# EAGLE board DR (EAGLE 9.4.2)
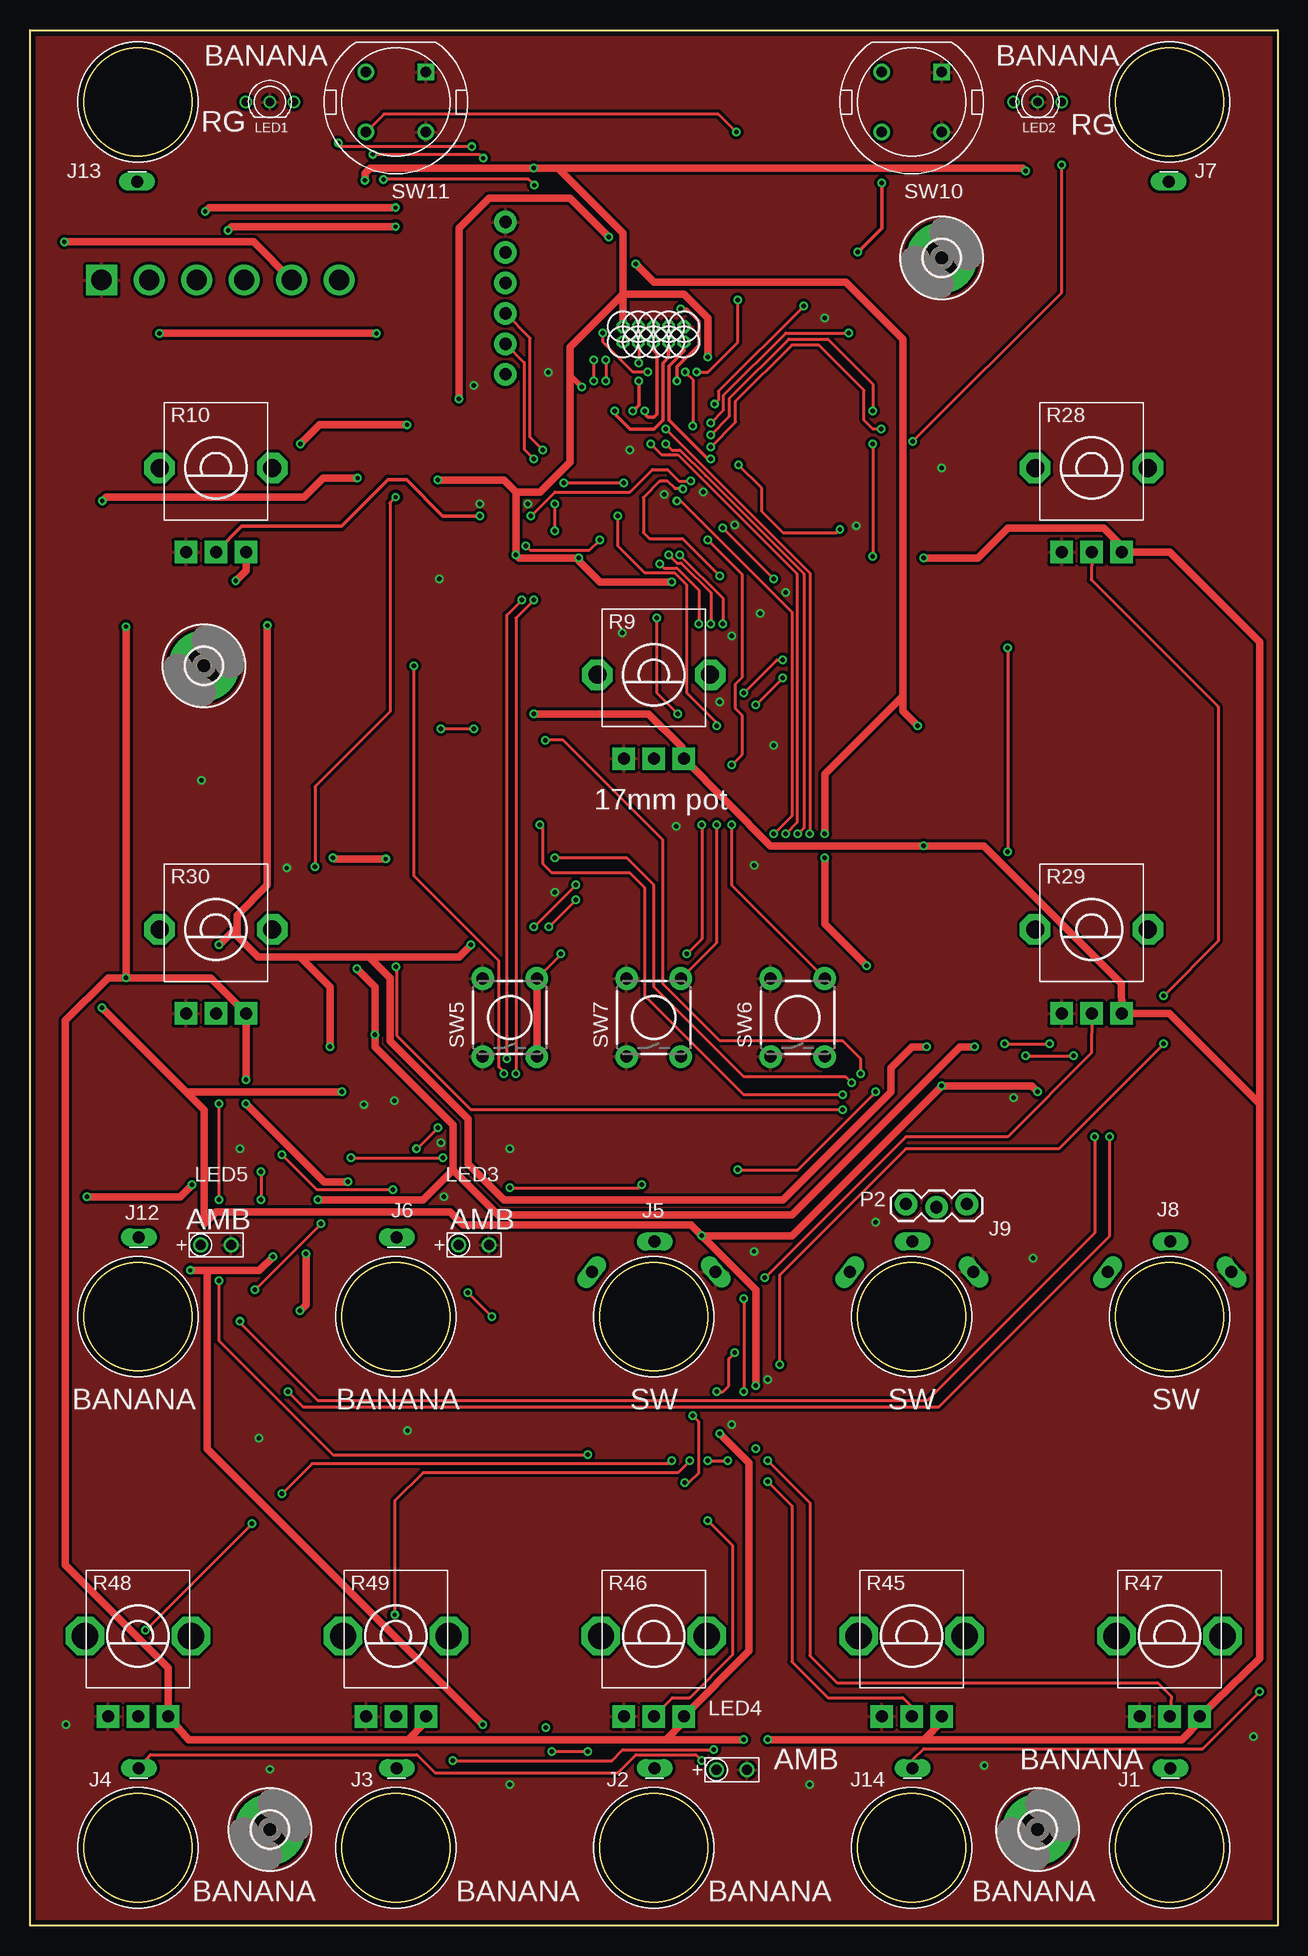
[diagram p5: board, top side]
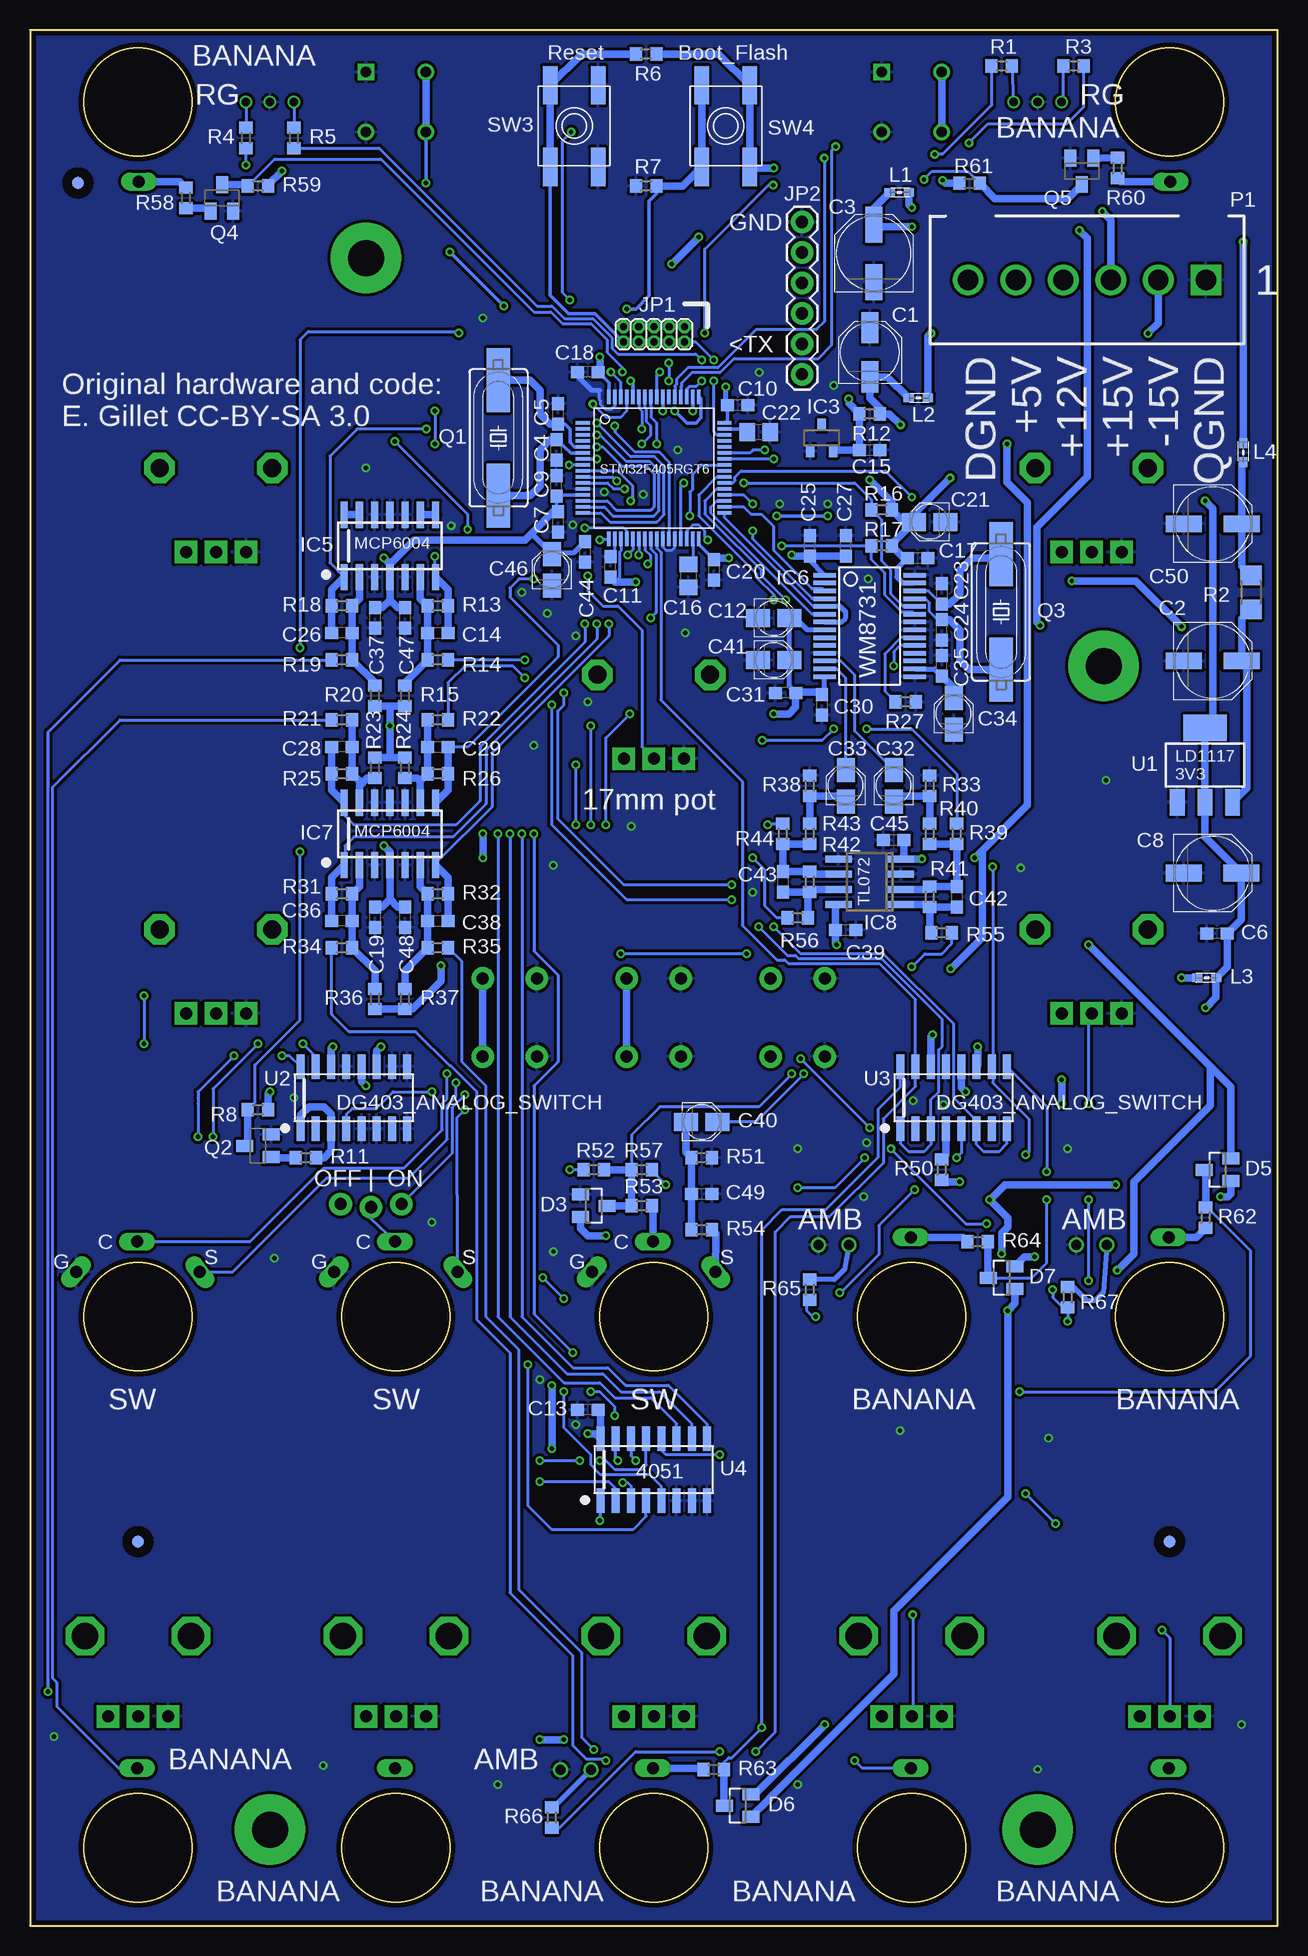
[diagram p6: board, bottom side, seen from below]

Size 104 x 158 mm. Coordinates in mm from the lower left corner, seen from the top.
Outline: 0,0 0,158 104,158 104,0 0,0
Copper layers (1*16): Top 0.0356mm / dielectric 1.5011mm / Bottom 0.0356mm
Design rules "LaenPCBOrder": minimum track width 6mil, minimum drill 13mil, track to track 6mil, track to pad 6mil, pad to pad 6mil, via to via 6mil, smd to smd 6mil, copper to edge 15mil, drill to drill 6mil, minimum pad ring 7mil, minimum via ring 7mil, stop-mask expansion 3mil, vias tented up to drill 0mil, thermal gap 10mil
Net classes: 0 default: width 0.203 mm

## Footprints (pad centres in the part's own frame; a part is rotated, then mirrored left to right if it is on the bottom)
PANASONIC_C = smd 2.6 x 1.4: + 2.05,0; - -2.05,0
PANASONIC_D = smd 3 x 1.4: + 2.4,0; - -2.4,0
C0603 = smd 1.1 x 1: 1 -0.85,0; 2 0.85,0
PANASONIC_A = smd 2 x 1.5: + 1.3,0; - -1.3,0
C0805 = smd 1.3 x 1.5: 1 -0.95,0; 2 0.95,0
SOT23 = smd 1 x 1.4: 1 -0.95,-1.1; 2 0.95,-1.1; 3 0,1.1
FIDUCIAL_1MM = smd 1 x 1: 1 0,0
3,0-PAD = drill 3 pad 5.842: B3,0 0,0
TQFP-10X10-64 = smd 1.2 x 0.3: 1 -5.936,3.75; 2 -5.936,3.25; 3 -5.936,2.75; 4 -5.936,2.25; 5 -5.936,1.75; 6 -5.936,1.25; 7 -5.936,0.75; 8 -5.936,0.25; 9 -5.936,-0.25; 10 -5.936,-0.75; 11 -5.936,-1.25; 12 -5.936,-1.75; 13 -5.936,-2.25; 14 -5.936,-2.75; 15 -5.936,-3.25; 16 -5.936,-3.75; 33 5.886,-3.75; 34 5.886,-3.25; 35 5.886,-2.75; 36 5.886,-2.25; 37 5.886,-1.75; 38 5.886,-1.25; 39 5.886,-0.75; 40 5.886,-0.25; 41 5.886,0.25; 42 5.886,0.75; 43 5.886,1.25; 44 5.886,1.75; 45 5.886,2.25; 46 5.886,2.75; 47 5.886,3.25; 48 5.886,3.75 | smd 0.3 x 1.2: 17 -3.75,-5.911; 18 -3.25,-5.911; 19 -2.75,-5.911; 20 -2.25,-5.911; 21 -1.75,-5.911; 22 -1.25,-5.911; 23 -0.75,-5.911; 24 -0.25,-5.911; 25 0.25,-5.911; 26 0.75,-5.911; 27 1.25,-5.911; 28 1.75,-5.911; 29 2.25,-5.911; 30 2.75,-5.911; 31 3.25,-5.911; 32 3.75,-5.911; 49 3.75,5.936; 50 3.25,5.936; 51 2.75,5.936; 52 2.25,5.936; 53 1.75,5.936; 54 1.25,5.936; 55 0.75,5.936; 56 0.25,5.936; 57 -0.25,5.936; 58 -0.75,5.936; 59 -1.25,5.936; 60 -1.75,5.936; 61 -2.25,5.936; 62 -2.75,5.936; 63 -3.25,5.936; 64 -3.75,5.936
DBZ_R-PDSO-G3 = smd 0.7 x 1: 1 -0.95,-1.1; 2 0.95,-1.1; 3 0,1.1
SO14 = smd 0.6 x 2.2: 1 -3.81,-2.6; 2 -2.54,-2.6; 3 -1.27,-2.6; 4 0,-2.6; 5 1.27,-2.6; 6 2.54,-2.6; 7 3.81,-2.6; 8 3.81,2.6; 9 2.54,2.6; 10 1.27,2.6; 11 0,2.6; 12 -1.27,2.6; 13 -2.54,2.6; 14 -3.81,2.6
SSOP28 = smd 0.381 x 1.905: 1 -4.55,-3.752; 2 -3.9,-3.752; 3 -3.25,-3.752; 4 -2.6,-3.752; 5 -1.95,-3.752; 6 -1.3,-3.752; 7 -0.65,-3.752; 8 0,-3.752; 9 0.65,-3.752; 10 1.3,-3.752; 11 1.95,-3.752; 12 2.6,-3.752; 13 3.25,-3.752; 14 3.9,-3.752; 15 3.9,3.752; 16 3.25,3.752; 17 2.6,3.752; 18 1.95,3.752; 19 1.3,3.752; 20 0.65,3.752; 21 0,3.752; 22 -0.65,3.752; 23 -1.3,3.752; 24 -1.95,3.752; 25 -2.6,3.752; 26 -3.25,3.752; 27 -3.9,3.752; 28 -4.55,3.752
SO08 = smd 0.6 x 2.2: 1 -1.905,-2.6; 2 -0.635,-2.6; 3 0.635,-2.6; 4 1.905,-2.6; 5 1.905,2.6; 6 0.635,2.6; 7 -0.635,2.6; 8 -1.905,2.6
JOHNSON = drill 1 long: 1 0.08,6.635
SWITCH_JOHNSON = drill 1 long: C 0.08,6.27; G 5.16,3.73; S -5.16,3.73
2X5-1.27 = drill 0.61 pad 1.067 octagon: 1 -1.27,3.81; 2 0,3.81; 3 -1.27,2.54; 4 0,2.54; 5 -1.27,1.27; 6 0,1.27; 7 -1.27,0; 8 0,0; 9 -1.27,-1.27; 10 0,-1.27
1X06 = drill 1.016 pad 1.88: 1 0,0; 2 2.54,0; 3 5.08,0; 4 7.62,0; 5 10.16,0; 6 12.7,0
0603 = smd 0.85 x 0.7: 1 -0.9,0; 2 0.7,0
LED-BICOLOR-THROUGHHOLE = drill 0.7: 1 -2,0; 2 0,0; 3 2,0
LED_3MM_MIN = drill 0.813: A -1.27,0; K 1.27,0
MTA_156 = drill 1.7 square: 1 -9.9,0 | drill 1.7: 2 -5.94,0; 3 -1.98,0; 4 1.98,0; 5 5.94,0; 6 9.9,0
1X03_LOCK = drill 1.016 pad 1.88: 1 0,0.127; 2 2.54,-0.127; 3 5.08,0.127
HC49UP = smd 5.334 x 1.93: 1 -4.826,0; 2 4.826,0
SOT23-BEC = smd 1 x 1.4: B -0.95,-1.1; C 0,1.1; E 0.95,-1.1
R0603 = smd 1 x 1.1: 1 -0.85,0; 2 0.85,0
R1206 = smd 1.6 x 1.803: 1 -1.422,0; 2 1.422,0
ALPS_POT_VERTICAL_PS = drill 1 pad 1.88 square: P$1 -2.5,7; P$2 0,7; P$3 2.5,7 | drill 1.5 pad 2.54 octagon: P$4 -4.7,0; P$5 4.7,0
ALPS_POT_VERTICAL = drill 1 pad 1.88 square: P$1 -2.5,6.7; P$2 0,6.7; P$3 2.5,6.7 | drill 2.2 pad 3.175 octagon: P$4 -4.4,0; P$5 4.4,0
EVQ-Q2 = smd 3.2 x 1.2: A -3.4,-2; A' 3.4,-2; B -3.4,2; B' 3.4,2
TACTILE-PTH = drill 1.016 pad 1.88: 1 -3.251,2.261; 2 3.251,2.261; 3 -3.251,-2.261; 4 3.251,-2.261
C&K_D6R = drill 0.9 square: 1 2.5,2.5 | drill 0.9: 2 2.5,-2.5; 3 -2.5,-2.5; 4 -2.5,2.5
SOT223 = smd 1.219 x 2.235: 1 -2.311,-3.099; 2 0,-3.099; 3 2.311,-3.099 | smd 3.6 x 2.2: TAB 0,3.099
SO16 = smd 0.66 x 2.032: 1 -4.445,-2.591; 2 -3.175,-2.591; 3 -1.905,-2.591; 4 -0.635,-2.591; 5 0.635,-2.591; 6 1.905,-2.591; 7 3.175,-2.591; 8 4.445,-2.591; 9 4.445,2.591; 10 3.175,2.591; 11 1.905,2.591; 12 0.635,2.591; 13 -0.635,2.591; 14 -1.905,2.591; 15 -3.175,2.591; 16 -4.445,2.591

## Placement (x,y rotation side)
C1  22u  [PANASONIC_C]  33.97,131.13 90 bottom
C2  47u  [PANASONIC_D]  5.4,105.41 0 bottom
C3  47u  [PANASONIC_D]  33.66,139.38 90 bottom
C4  18p  [C0603]  60.12,123 90 bottom
C5  18p  [C0603]  60,126 270 bottom
C6  100n  [C0603]  5.05,82.68 180 bottom
C7  1u  [C0603]  60,117 270 bottom
C8  47u  [PANASONIC_D]  5.41,87.73 0 bottom
C9  100n  [C0603]  60.12,120 90 bottom
C10  100n  [C0603]  45,126.75 0 bottom
C11  100n  [C0603]  55.62,113.25 90 bottom
C12  10u  [PANASONIC_A]  42,109 0 bottom
C13  100n  [C0603]  57.5,43 180 bottom
C14  2.2n  [C0603]  70,107.75 0 bottom
C15  100n  [C0603]  34,123 0 bottom
C16  2.2u  [C0805]  49.12,112.5 270 bottom
C17  100n  [C0603]  30,114 0 bottom
C18  1u  [C0603]  57.5,129.5 180 bottom
C19  100n  [C0603]  75.25,84.05 270 bottom
C20  100n  [C0603]  47,113 270 bottom
C21  10u  [PANASONIC_A]  29,117 180 bottom
C22  2.2u  [C0805]  43.25,124.5 0 bottom
C23  18p  [C0603]  28,111 270 bottom
C24  18p  [C0603]  28,108 90 bottom
C25  100n  [C0603]  39,115 90 bottom
C26  10n  [C0603]  78,107.75 180 bottom
C27  100n  [C0603]  36,115 90 bottom
C28  10n  [C0603]  78,98.25 180 bottom
C29  2.2n  [C0603]  70,98.25 0 bottom
C30  1u  [C0603]  38,101.75 270 bottom
C31  100n  [C0603]  41,102.75 180 bottom
C32  10u  [PANASONIC_A]  32,95 90 bottom
C33  10u  [PANASONIC_A]  36,95 90 bottom
C34  10u  [PANASONIC_A]  27,101 90 bottom
C35  100n  [C0603]  28,105 90 bottom
C36  10n  [C0603]  78,83.75 180 bottom
C37  100n  [C0603]  75.25,109 270 bottom
C38  10n  [C0603]  70,83.75 0 bottom
C39  100n  [C0603]  36,83 0 bottom
C40  10u  [PANASONIC_A]  48,67 0 bottom
C41  10u  [PANASONIC_A]  42,105.5 0 bottom
C42  18p  [C0603]  26.75,85.75 270 bottom
C43  18p  [C0603]  41.25,87 270 bottom
C44  100n  [C0603]  57.75,114.5 270 bottom
C45  100n  [C0603]  32,90.5 0 bottom
C46  10u  [PANASONIC_A]  60.5,113 90 bottom
C47  100n  [C0603]  72.75,109 270 bottom
C48  100n  [C0603]  72.75,84.05 270 bottom
C49  220p  [C0603]  48,61 0 bottom
C50  47u  [PANASONIC_D]  5.4,116.84 0 bottom
D3  BAT54S  [SOT23]  57,60 270 bottom
D5  BAT54S  [SOT23]  5,63 90 bottom
D6  BAT54S  [SOT23]  45,10 90 bottom
D7  BAT54S  [SOT23]  23,54 90 bottom
FD1  FIDUCIAL  [FIDUCIAL_1MM]  9,32 0 bottom
FD2  FIDUCIAL  [FIDUCIAL_1MM]  95,32 0 bottom
FD3  FIDUCIAL  [FIDUCIAL_1MM]  100,145.25 0 bottom
H1  3MM_MOUNT_HOLE  [3,0-PAD]  20,8 0 top
H2  3MM_MOUNT_HOLE  [3,0-PAD]  84,8 0 top
H3  3MM_MOUNT_HOLE  [3,0-PAD]  76,139 0 top
H4  3MM_MOUNT_HOLE  [3,0-PAD]  14.5,105 0 top
IC2  STM32F405RGT6  [TQFP-10X10-64]  51.99,121.49 0 bottom
IC3  LM4040B10  [DBZ_R-PDSO-G3]  38,124 0 bottom
IC5  MCP6004  [SO14]  74,115 0 bottom
IC6  WM8731  [SSOP28]  34,108 270 bottom
IC7  MCP6004  [SO14]  74,91 0 bottom
IC8  TL072  [SO08]  34,87 90 bottom
J1  JOHNSON_BANANASTD  [JOHNSON]  95,6.48 0 top
J2  JOHNSON_BANANASTD  [JOHNSON]  52,6.48 0 top
J3  JOHNSON_BANANASTD  [JOHNSON]  30.5,6.48 0 top
J4  JOHNSON_BANANASTD  [JOHNSON]  9,6.48 0 top
J5  SWITCHCRAFT_42A  [SWITCH_JOHNSON]  52,50.73 0 top
J6  JOHNSON_BANANASTD  [JOHNSON]  30.5,50.73 0 top
J7  JOHNSON_BANANASTD  [JOHNSON]  95,152 180 top
J8  SWITCHCRAFT_42A  [SWITCH_JOHNSON]  95,50.73 0 top
J9  SWITCHCRAFT_42A  [SWITCH_JOHNSON]  73.5,50.73 0 top
J12  JOHNSON_BANANASTD  [JOHNSON]  9,50.73 0 top
J13  JOHNSON_BANANASTD  [JOHNSON]  9,152 180 top
J14  JOHNSON_BANANASTD  [JOHNSON]  73.5,6.48 0 top
JP1  M05X2MINIJTAG  [2X5-1.27]  53.24,132 270 bottom
JP2  [1X06]  39.63,142 270 bottom
L1  FB R0603  [0603]  31.43,144.46 0 bottom
L2  FB R0603  [0603]  29.84,127.32 0 bottom
L3  [0603]  6,79 180 bottom
L4  FB R0603  [0603]  2.86,122.87 90 bottom
LED1  WP115VEGW  [LED-BICOLOR-THROUGHHOLE]  20,152 0 top
LED2  WP115VEGW  [LED-BICOLOR-THROUGHHOLE]  84,152 0 top
LED3  LED_3MM_MIN  [LED_3MM_MIN]  37,56.73 0 top
LED4  LED_3MM_MIN  [LED_3MM_MIN]  58.5,12.98 0 top
LED5  LED_3MM_MIN  [LED_3MM_MIN]  15.5,56.73 0 top
P1  BU_PWR_NO_I2C  [MTA_156]  15.88,137.16 180 bottom
P2  [1X03_LOCK]  73.03,60.01 0 top
Q1  8MHz  [HC49UP]  64.95,124 90 bottom
Q2  MMBT3904  [SOT23-BEC]  85,65 90 bottom
Q3  12.288MHz  [HC49UP]  23.05,109.5 270 bottom
Q4  MMBT3904  [SOT23-BEC]  88,144 0 bottom
Q5  MMBT3904  [SOT23-BEC]  16.32,146.22 180 bottom
R1  180  [R0603]  23,155 0 bottom
R2  4.7  [R1206]  2.22,111.12 90 bottom
R3  180  [R0603]  17,155 180 bottom
R4  180  [R0603]  86,149 90 bottom
R5  180  [R0603]  82,149 90 bottom
R6  10k  [R0603]  52.63,156 0 bottom
R7  10k  [R0603]  52.63,145 0 bottom
R8  10k  [R0603]  85,68 0 bottom
R9  10kB  [ALPS_POT_VERTICAL_PS]  52,104.25 180 top
R10  10kB  [ALPS_POT_VERTICAL_PS]  15.5,121.49 180 top
R11  100k  [R0603]  81,64 180 bottom
R12  2.2k  [R0603]  34,126 180 bottom
R13  47k  [R0603]  70,110 180 bottom
R14  100k  [R0603]  70,105.5 0 bottom
R15  180k  [R0603]  72.75,102.5 270 bottom
R16  2.2k  [R0603]  33,118 0 bottom
R17  2.2k  [R0603]  33,115 0 bottom
R18  10K  [R0603]  78,110 0 bottom
R19  100k  [R0603]  78,105.5 180 bottom
R20  62K  [R0603]  75.25,102.5 270 bottom
R21  100k  [R0603]  78,100.5 180 bottom
R22  100k  [R0603]  70,100.5 0 bottom
R23  62K  [R0603]  75.25,96.5 90 bottom
R24  62K  [R0603]  72.75,96.5 90 bottom
R25  10K  [R0603]  78,96 0 bottom
R26  10K  [R0603]  70,96 180 bottom
R27  36k  [R0603]  31,102 0 bottom
R28  10kB  [ALPS_POT_VERTICAL_PS]  88.5,121.49 180 top
R29  10kB  [ALPS_POT_VERTICAL_PS]  88.5,83.03 180 top
R30  10kB  [ALPS_POT_VERTICAL_PS]  15.5,83.03 180 top
R31  10K  [R0603]  78,86 0 bottom
R32  10K  [R0603]  70,86 180 bottom
R33  47k  [R0603]  29,95 270 bottom
R34  100k  [R0603]  78,81.5 180 bottom
R35  100k  [R0603]  70,81.5 0 bottom
R36  62K  [R0603]  75.25,77.23 270 bottom
R37  62K  [R0603]  72.75,77.23 270 bottom
R38  47k  [R0603]  39,95 270 bottom
R39  47k  [R0603]  26.75,91 90 bottom
R40  16K  [R0603]  29,91 90 bottom
R41  47k  [R0603]  29,85.75 90 bottom
R42  47k  [R0603]  39,87 90 bottom
R43  16K  [R0603]  39,91 90 bottom
R44  47k  [R0603]  41.25,91 90 bottom
R45  10kB  [ALPS_POT_VERTICAL]  73.5,24.13 180 top
R46  10kB  [ALPS_POT_VERTICAL]  52,24.13 180 top
R47  10kB  [ALPS_POT_VERTICAL]  95,24.13 180 top
R48  10kB  [ALPS_POT_VERTICAL]  9,24.13 180 top
R49  10kB  [ALPS_POT_VERTICAL]  30.5,24.13 180 top
R50  3.3M  [R0603]  28,63 270 bottom
R51  16K  [R0603]  48,64 180 bottom
R52  100k  [R0603]  57,63 180 bottom
R53  1M  [R0603]  53,60 0 bottom
R54  36k  [R0603]  48,58 0 bottom
R55  1.0k  [R0603]  28,82.75 180 bottom
R56  1.0k  [R0603]  40,84 0 bottom
R57  470k  [R0603]  53,63 0 bottom
R58  100k  [R0603]  91,144 270 bottom
R59  10k  [R0603]  85,145 0 bottom
R60  100k  [R0603]  13.34,146.49 90 bottom
R61  10k  [R0603]  25.67,145.22 180 bottom
R62  2.2K  [R0603]  6,59 90 bottom
R63  2.2K  [R0603]  47,13 0 bottom
R64  2.2K  [R0603]  25,57 0 bottom
R65  510R  [R0603]  39,53 270 bottom
R66  510R  [R0603]  60.5,9 270 bottom
R67  510R  [R0603]  17.5,52.37 270 bottom
SW3  [EVQ-Q2]  58.63,150 90 bottom
SW4  [EVQ-Q2]  46,150 270 bottom
SW5  [TACTILE-PTH]  40,75.69 90 top
SW6  [TACTILE-PTH]  64,75.69 90 top
SW7  [TACTILE-PTH]  52,75.69 90 top
SW10  [C&K_D6R]  73.5,152 0 top
SW11  [C&K_D6R]  30.5,152 0 top
U1  LM1117MPX-3.3  [SOT223]  6.05,96.73 0 bottom
U2  DG403_ANALOG_SWITCH  [SO16]  77,69 0 bottom
U3  DG403_ANALOG_SWITCH  [SO16]  27,69 0 bottom
U4  4051  [SO16]  52,38 0 bottom

## Tracks (layer width: path | path; a pad name or v marks a point on that pad's centre or on a via)
+3V3  (via drill 0.35)
  Top 0.406: v46,128.25 45,129.25
  Top 0.61: v6,76.5 13,69.5 | 13,69.5 v26,69.5 | 13,69.5 14.54,67.96 14.54,58.5 15.54,59.5 35,59.5 36.12,58.38 55.12,58.38 v56,57.5 | v56,57.5 63.5,57.5 v76,70 83.5,70 v84,69.5 | 44,146.5 v42,146.5 28.36,146.5 27.92,146.05 v27.92,145.47 | 44,146.5 49.44,141.06 49.44,136 | 49.44,136 JP1.1 | 49.44,136 54.5,136 56.5,134 v56.5,130.75 | 49.44,136 45,131.56 45,129.25 45,122 42.5,119.5 40.5,119.5 | v56,57.5 60.5,53 v60.5,45 | 40.5,119.5 v40.5,114.25 40.75,114 v45.75,114 45.75,113.75 47.5,112 v53.5,112 | 40.5,119.5 39.5,120.5 v34,120.5 | v83,146.25 82.75,146.5 44,146.5 | v6.03,118.75 6.35,119.06 22.86,119.06 24.45,120.65 v27.3,120.65
  Bottom 0.254: C18.1 56.5,129.65 | IC2.19 54.75,115.56 54.75,114.59 54.85,114.5 54.85,112.38 55.23,112
  Bottom 0.305: C18.1 55.74,128.59 IC2.64 | C10.1 45.85,125.49 IC2.48 | C20.1 48.24,115.09 IC2.32
  Bottom 0.406: IC6.1 39,113.8 C25.1 | C17.1 31.75,113.1 31.75,112.41 31.24,111.9 IC6.27 | C10.1 46,126.9 v46,128.25
  Bottom 0.61: v6,76.5 5.15,77.35 5.15,79.05 L3.1 4.2,79.9 C6.1 3.01,83.87 C8.+ 6.05,90.77 U1.2 U1.TAB 5.4,100.48 5.4,118.11 v6.03,118.75 | v26,69.5 26.36,69.86 U3.12 | v56,57.5 57.5,57.5 58.1,58.1 D3.2 | v76,70 76.36,70.36 U2.12 | v84,69.5 84.15,69.35 R8.2 | v42,146.5 43.9,146.5 SW4.B' SW4.B 46.6,156 R6.2 | 56.5,129.65 v56.5,130.75 | v34,120.5 32.15,118.65 R16.2 31.15,117 C21.+ | C21.+ 32.15,115.15 R17.2 31.15,114 C17.1 | C27.1 C25.1 40.4,114.15 v40.5,114.25 | v45.75,114 46.85,114 C20.1 | v60.5,45 v60.5,39.75 | v53.5,112 55.23,112 C11.1 | v83,146.25 84.15,145.1 R59.2 | v27.92,145.47 27.67,145.22 R61.2 | v27.3,120.65 30.3,117.66 C21.+
+3V3_A  (via drill 0.35)
  Top 0.61: v8,79 15.05,79 16.9,77.15 16.9,77.13 R30.P$1 v18,70.5 | v18,68.5 24.5,62 v26.5,62 | v8,79 6.5,79 2.92,75.42 2.92,30.07 11.5,21.5 R48.P$1 13.24,15.5 31.5,15.5 | 31.5,15.5 32.9,16.9 R49.P$1 | 31.5,15.5 53,15.5 | 53,15.5 54.49,16.99 R46.P$1 59.95,22.9 59.95,38.55 v57.5,41 | 53,15.5 v59.5,15.5 | v61.5,15.5 74.5,15.5 | 74.5,15.5 76.08,17.07 R45.P$1 | 74.5,15.5 96,15.5 97.66,17.16 R47.P$1 102.5,22.26 102.5,68.5 | 102.5,68.5 94.97,76.03 R29.P$1 90.97,78.53 79.5,90 v74.5,90 61.74,90 R9.P$1 54.34,97.42 54.34,98.22 51.56,101 v42,101 | 102.5,68.5 102.5,107 95,114.5 94.99,114.49 R28.P$1 90.97,115.03 89.5,116.5 81.5,116.5 79,114 v74.5,114 | v8,108.27 v8,79 | v17.14,112.08 18,112.93 R10.P$1
  Bottom 0.305: C46.+ 60.4,114.4 | IC2.13 60.04,119.24 C9.1 60.12,117.97 C7.1
  Bottom 0.406: IC6.8 39.2,108 40.2,109 C12.+ C41.+ 40.7,103.3 C31.1 | C30.1 37.75,102.85 IC6.14 | C44.1 58.7,114.4 60.4,114.4 | C46.+ 62,115.8 62,116.25
  Bottom 0.61: L3.2 v8,79 | v18,70.5 v18,68.5 | v26.5,62 27.85,62 R50.2 | v59.5,15.5 v61.5,15.5 | v57.5,41 56.85,41 U4.16 56.45,42.8 C13.1 | v74.5,90 74,89.5 IC7.4 74,85.55 | 74,85.55 74.65,84.9 C19.1 | 74,85.55 73.35,84.9 C48.1 | v74.5,114 74,113.5 | 74,113.5 IC5.4 74,110.5 | 74,110.5 74.65,109.85 C37.1 | 74,110.5 73.35,109.85 C47.1 | 40.2,102.8 C31.1 | C30.1 38.2,102.8 40.2,102.8 | v42,101 40.75,101 40.2,101.55 40.2,102.8 | 74,113.5 72,115.5 62.75,115.5 62,116.25 60.4,117.85 C7.1 | v17.14,112.08 11.81,112.08 v8,108.27
+5V
  Bottom 0.61: L4.1 3,121.83 C50.+ 3,113.32 R2.2
AREF_-10  (via drill 0.35)
  Top 0.61: v35.75,127.25 35.75,141.5 38.25,144 45,144 v48.25,140.75 | v50.5,138.5 52,137 68,137 72.75,132.25 72.75,102.5 | 72.75,102.5 66.25,96 v66.25,91 | 72.75,102.5 72.75,101.25 v74,100 | v66.25,89 66.25,83.5 v69.75,80
  Bottom 0.61: IC3.2 36.95,123 C15.1 R12.2 35.75,126.9 v35.75,127.25 | v48.25,140.75 v50.5,138.5 | v66.25,91 v66.25,89 | R20.2 74,101.65 | 74,101.65 R15.2 | 74,101.65 v74,100 74,97.35 | R36.2 R37.2 72.11,76.38 69.75,78.75 v69.75,80 | R23.2 74,97.35 | 74,97.35 R24.2
AUX_OUT
  Bottom 0.254: C33.+ 36,104 36.75,104.75 IC6.13
BOOT_FLASH  (via drill 0.35)
  Top 0.305: v54.25,134.75 54.75,134.75 55.75,133.75 55.75,131.75 53.93,129.93 v53.93,128.75
  Bottom 0.305: v54.25,134.75 53.5,134.75 52.38,135.87 52.38,143.75 51.78,144.35 R7.2 | v53.93,128.75 53.74,128.55 IC2.60
  Bottom 0.61: SW4.A SW4.A' 49.6,145 R7.2
BRIGHTNESS_ATT  (via drill 0.35)
  Top 0.254: v61.5,37 63.5,35 63.5,22 66.5,19 72.75,19 73.58,18.18 R45.P$2
  Bottom 0.254: U4.2 55.17,36.42 55.75,37 v61.5,37
BRIGHTNESS_CV  (via drill 0.35)
  Top 0.254: v56.75,123.25 58.82,125.32 58.82,127.07 63.5,131.75 65.75,131.75 69.54,127.96 69.54,125.46 70.25,124.75 v70.96,124.75
  Bottom 0.254: IC2.14 55.87,118.74 55.13,118 52.25,118 51.95,118.3 51.95,121 52.58,121.62 54.62,121.62 56.25,123.25 v56.75,123.25 | v70.96,124.75 76.75,124.75 79,122.5 79,113.59 IC5.1
  Bottom 0.61: IC5.1 78.85,111.36 R18.1 C26.2
BRIGHTNESS_POT  (via drill 0.35)
  Top 0.254: v62.5,46.75 62.5,54.25 73,64.75 85.75,64.75 v94.5,73.5 | R28.P$2 88.47,112.19 99.06,101.6 99.06,82.06 v94.5,77.5
  Bottom 0.254: U4.4 52.63,34.12 53.75,33 60.5,33 62.5,35 v62.5,46.75 | v94.5,77.5 v94.5,73.5
CV_NORMALIZATION  (via drill 0.35)
  Top 0.254: v26.75,64 v34.41,64 | v40,61.5 50.75,61.5 v51,61.75
  Bottom 0.254: U3.5 26.36,64.39 v26.75,64 | v34.41,64 36.91,61.5 v40,61.5 | v51,61.75 52.15,62.9 R57.2
DAMP_ATT  (via drill 0.35)
  Top 0.254: v56.5,38.75 v58.16,38.75 | v61.5,38.75 65,35.25 65,22.5 67.25,20.25 94,20.25 95.16,19.09 R47.P$2
  Bottom 0.254: U4.13 52.63,38.37 53,38 55.25,38 56,38.75 v56.5,38.75 | v58.16,38.75 v61.5,38.75
DAMP_CV  (via drill 0.35)
  Top 0.254: v54.16,114.25 57.75,110.66 v57.75,108.5
  Bottom 0.254: IC2.21 53.75,115.56 53.75,114.68 53.91,114.52 53.91,114.5 v54.16,114.25 | v57.75,108.5 57.75,107 66.5,98.25 66.5,93.75 68.5,91.75 77,91.75 77.81,92.56 IC7.14
  Bottom 0.61: IC7.14 78.85,94.64 R25.1 C28.2
DAMP_POT  (via drill 0.35)
  Top 0.254: R29.P$2 88.47,72.72 81.5,65.75 73,65.75 v61.25,54 | v59.5,52.25 v59.5,44.5
  Bottom 0.254: v61.25,54 v59.5,52.25 | U4.5 51.37,36.62 52.33,37.58 56.42,37.58 57.25,38.41 57.25,39.25 59.5,41.5 v59.5,44.5
FM_CV  (via drill 0.35)
  Top 0.254: v57.75,116.5 v62,112.25
  Bottom 0.254: IC2.20 54.24,116.24 54.5,116.5 v57.75,116.5 | v62,112.25 63.25,112.25 64,111.5 64,110.75 60,106.75 60,105.75 67.5,98.25 C29.2
  Bottom 0.61: IC7.8 69.15,94.64 R26.1 C29.2
FM_INPUT  (via drill 0.35)
  Bottom 0.254: R63.2 46.15,13.6 45.75,14 45.5,14 v43,16.5 43,57.97 41.3,59.67 37.66,59.67 33.28,64.04 33.28,68.04 31.45,69.88 U3.16
  Bottom 0.61: R63.2 46.15,10.05 D6.3
FM_NORM
  Bottom 0.61: R50.1 27.64,64.22 U3.4
FM_SOURCE  (via drill 0.35)
  Top 0.254: v43.25,83.25 v45.5,85.5 | v60.5,101.75 v62.75,104
  Bottom 0.254: U3.1 31.45,65.19 30.75,64.5 29.5,64.5 28.91,65.09 U3.3 28.91,68.84 28.25,69.5 28.25,73 28,73.25 28,75.58 33.02,80.59 39.92,80.59 40.2,80.88 40.88,80.88 v43.25,83.25 | v45.5,85.5 54.25,85.5 60.5,91.75 v60.5,101.75 | v62.75,104 63.75,105 67.75,105 69.15,103.6 R22.2
FREQUENCY_ATT  (via drill 0.35)
  Top 0.254: R46.P$2 53.56,19 55,19 58.59,22.59 58.59,31.66 v56.5,33.75
  Bottom 0.254: v56.5,33.75 56.45,33.8 U4.1
FREQUENCY_POT  (via drill 0.35)
  Top 0.254: v57.5,112.5 54.38,115.62 51.62,115.62 51.12,116.12 51.12,119.03 52.48,120.39 53.16,120.39 53.8,119.75 v54.43,119.75
  Bottom 0.254: R9.P$2 53,98.27 53,108 55,110 56.25,110 57.5,111.25 v57.5,112.5 | IC2.11 55.85,120.24 55.36,119.75 v54.43,119.75
GATE_MODE  (via drill 0.35)
  Top 0.254: v54.62,129.5 55.25,128.87 v55.25,125
  Bottom 0.254: R59.1 83.6,147.25 74.75,147.25 62,134.5 60.58,134.5 59.61,133.54 57.24,133.54 55.91,132.21 55.91,131.16 54.62,129.87 v54.62,129.5 | v55.25,125 55.25,124.5 53.59,122.84 51.58,122.84 50.74,122 IC2.27
  Bottom 0.61: Q4.C 85.95,145.1 R59.1
GATE_POLY  (via drill 0.35)
  Top 0.254: v51.5,129.5 50.25,129.5 47.75,132 v47.75,132.75 | v42.04,145.07 41.56,145.54 v29.48,145.54
  Bottom 0.254: IC2.56 51.74,129.26 v51.5,129.5 | v47.75,132.75 47.75,139.75 42.43,145.07 v42.04,145.07 | v29.48,145.54 28.8,146.22 25.82,146.22 R61.1
  Bottom 0.61: Q5.C 17.49,143.95 23.55,143.95 R61.1
GEOMETRY_ATT  (via drill 0.35)
  Top 0.254: v53.5,38.75 53.25,38.5 23.5,38.5 v21,36 | v9.62,24.62 v18.5,33.5
  Bottom 0.254: U4.14 53.91,39.16 v53.5,38.75 | v18.5,33.5 v21,36 | v9.62,24.62 9,24 R48.P$2
GEOMETRY_CV  (via drill 0.35)
  Top 0.254: v53.25,114.25 53.5,114 53.5,113.98 53.92,113.56 54.27,113.56 56.75,111.09 v56.75,108.5
  Bottom 0.254: IC2.22 53.24,114.26 v53.25,114.25 | v56.75,108.5 56.75,107.25 66,98 66,93.5 68.75,90.75 77,90.75 77.75,90 77.75,88.46 IC7.1
  Bottom 0.61: IC7.1 78.85,87.36 R31.1 C36.2
GEOMETRY_POT  (via drill 0.35)
  Top 0.254: v41.75,117.5 43.75,119.5 50,119.5 51.88,121.38 53.12,121.38 54.09,120.41 v55.09,120.41
  Top 0.305: v37.5,117.5 34.41,117.5 31.38,120.53 29.84,120.53 25.96,116.64 17.66,116.64 R10.P$2
  Bottom 0.254: IC2.10 55.42,120.74 v55.09,120.41
  Bottom 0.305: v37.5,117.5 v41.75,117.5
GND  (via drill 0.35)
  Bottom 0.254: C11.2 55.25,114.47 55.25,114.66 55.24,114.68 IC2.18 | IC2.26 51.24,114.89 50.99,114.64 50.48,114.64 50.24,114.89 IC2.28 | IC2.63 55.24,126.69 55.56,126.36 56.04,126.36 56.44,126.76 56.44,127.08 56.52,127.16 56.52,127.95
  Bottom 0.406: 56.52,127.95 57.15,127.95 58.35,129.15 C18.2
  other vias: 65,11.75 79.56,13.34 102,15.75 40,11.75 20,13.02 3,16.75 61.5,45.5 58.5,41.75 76,121.5 68.89,116.68 66.25,134 50,123 60.88,109.38 57.5,102 21.41,88.15 14.3,95.45 40,64.75 17.5,64.75 34.5,60.75 34.25,65.25 82,69 56.12,119.5 63,111.12 58.75,116.75 41.5,118.5 37,128.38 34.12,112.25 37.5,118.5 58.5,107.5 62,98.38 60.38,88.38 53.88,91.62 43.75,86.12 70.5,58.62 83.62,55.62 30.38,68.75 52.88,119.3 49.38,107.75 43.2,129.46 27.84,68.43 19.09,40.62 31.47,41.26 60.36,56.18
  pour Bottom (isolate 0.254): 103.68,0.32 103.68,157.68 0.32,157.68 0.32,0.32
  pour Top (isolate 0.254): 103.68,0.32 103.68,157.68 0.32,157.68 0.32,0.32
I2C_SCL  (via drill 0.35)
  Top 0.254: v49.5,120.25 v44.5,120.25
  Bottom 0.254: IC6.24 31.2,109.95 32.25,111 32.25,113 33,113.75 33,117.15 R16.1 33.85,118.85 35.25,120.25 v44.5,120.25 | IC2.29 49.74,120.01 v49.5,120.25
I2C_SDA  (via drill 0.35)
  Top 0.254: v41.34,115 41.68,114.66 46.66,114.66 v47.5,115.5
  Bottom 0.254: IC6.23 30.43,109.48 31.32,109.48 32.75,110.91 32.75,112.75 33.85,113.85 R17.1 v41.34,115 | IC2.30 49.24,116.26 48.75,116.75 48.25,116.75 47.75,116.25 47.75,115.75 v47.5,115.5
I2S_LRCK
  Bottom 0.254: IC6.5 38.7,109.95 46.1,117.35 IC2.33
  Bottom 0.406: IC6.7 36.35,108.65 36,109 36,109.5 36.45,109.95 IC6.5
I2S_SCK
  Bottom 0.254: IC6.3 37.93,111.43 38.82,111.43 42,114.61 42,116.62 43,117.62 43.88,117.62 44.49,118.24 IC2.34
I2S_SIN
  Bottom 0.254: IC6.6 38.8,109.3 46.81,117.31 46.82,117.31 47.25,117.74 47.25,118.25 46.76,118.74 IC2.35
I2S_SOUT  (via drill 0.35)
  Top 0.254: v43.75,116.25 43.75,117.62 v43.75,118.5
  Bottom 0.254: IC6.4 38.77,110.6 43.75,115.58 v43.75,116.25 | v43.75,118.5 44.49,119.24 IC2.36
IN_1
  Bottom 0.254: IC6.20 31.4,107.35 32.75,106 32.75,102.9 R27.1
IN_2  (via drill 0.35)
  Top 0.254: v32,105 32,87.5 39.1,80.4 39.1,71.56 39.5,71.16 v39.5,71
  Bottom 0.254: IC6.19 31.48,106.7 32,106.17 v32,105 | v39.5,71 43.5,67 C40.+
JTCK  (via drill 0.35)
  Top 0.254: JP1.4 50.75,131.96 v50.75,130.25
  Top 0.305: v50.25,126.25 50.75,126.75 v50.75,128.75
  Bottom 0.254: v50.75,130.25 v50.75,128.75
  Bottom 0.305: IC2.49 48.07,127.25 48.07,125.68 48.5,125.25 49.25,125.25 v50.25,126.25
JTDI  (via drill 0.35)
  Top 0.305: JP1.8 53.24,130.75 52.75,130.25 52.75,125.5 52,124.75 50,124.75 48.75,126 v48.75,126.25
  Bottom 0.305: v48.75,126.25 48.75,127.41 IC2.50
JTDO  (via drill 0.35)
  Top 0.305: JP1.6 51.98,131.29 52.25,131.02 52.25,126 52,125.75 51.5,125.75 51.25,126 v51.25,126.25
  Bottom 0.305: IC2.55 51.24,126.26 v51.25,126.25
JTMS  (via drill 0.35)
  Top 0.254: v47,128.75 v47,130.5
  Bottom 0.254: IC2.46 46.11,124.25 46.76,124.25 47,124.49 v47,128.75 | v47,130.5 48.5,132 JP1.2
MAIN_OUT
  Bottom 0.254: C32.+ 35.25,99.55 35.25,104.25 36.4,105.4 IC6.12
MUX_ADDR_0  (via drill 0.35)
  Top 0.254: v53,124.75 65,112.75 v65,91
  Bottom 0.254: v65,91 65,50.75 59.5,45.25 56.5,45.25 55.25,44 52.25,44 50.09,41.84 U4.11 | IC2.59 53.24,126.49 53,126.25 v53,124.75
MUX_ADDR_1  (via drill 0.35)
  Top 0.254: v53,123.5 53.5,123 54.17,123 56.34,120.84 64.5,112.67 64.5,91.5 v64,91
  Bottom 0.254: v64,91 64,50.75 59.25,46 56.25,46 54.75,44.5 51.5,44.5 48.83,41.83 U4.10 | v53,123.5 52.25,124.25 52.25,125 52.59,125.34 52.59,126.42 52.74,126.56 IC2.58
MUX_ADDR_2  (via drill 0.35)
  Top 0.254: v51.75,123.5 52.62,122.62 53.3,122.62 53.33,122.59 54.01,122.59 63.92,112.67 63.92,91.92 v63,91
  Bottom 0.254: v63,91 63,50.75 58.75,46.5 55.83,46.5 54.35,45.02 50.77,45.02 47.55,41.8 U4.9 | v51.75,123.5 51.75,125.25 52.19,125.69 52.19,126.59 52.24,126.64 IC2.57
MUXED_POTS  (via drill 0.35)
  Top 0.254: v54.59,36.92 54.92,36.92 55.75,37.75 55.75,42 v55.25,42.5 | v57.25,44.5 57.75,44.5 58.25,45 58.25,47.25 v58.75,47.75 | v62,91 63.5,92.5 63.5,109.5 54.25,118.75 v53.93,118.75
  Bottom 0.254: v62,91 62,81.25 60,79.25 60,72 62,70 62,51 v58.75,47.75 | v54.59,36.92 54.17,36.92 53.91,36.66 U4.3 | v53.93,118.75 53.75,118.93 53.75,120 54.99,121.24 IC2.9 | v55.25,42.5 55.25,43.25 56.5,44.5 v57.25,44.5
N$1  (via drill 0.35)
  Top 0.254: J14.1 73.66,13.9 74.5,14.75 97.75,14.75 v102.5,19.5
  Bottom 0.254: v102.5,19.5 102.5,99.5 96.5,105.5 R19.2
N$2
  Bottom 0.61: IC5.2 76.54,110.61 R18.2 C26.1 R19.1 75.25,103.6 R20.1
N$3
  Bottom 0.61: R58.2 89.2,143.15 Q4.B
N$4
  Bottom 0.61: Q5.B 14.79,147.32 R60.2
N$5
  Bottom 0.61: IC7.9 71.46,95.39 | 71.46,95.39 R26.2 C29.1 R22.1 | 71.46,95.39 71.72,95.65 R24.1
N$6  (via drill 0.35)
  Top 0.254: J4.1 10.03,14.25 32.25,14.25 33.75,12.75 49,12.75 50.5,14.25 55.5,14.25 v56,13.75
  Bottom 0.254: v56,13.75 56.16,13.91 57.66,13.91 58.75,15 58.75,22.5 64,27.75 64,47.75 66.75,50.5 66.75,69.5 68.91,71.66 69,71.66 71.84,74.5 77.41,74.5 78.85,75.94 R34.2
N$7
  Bottom 0.305: C5.2 59.4,125.15 59,124.75 59,123.63 58.6,123.24 IC2.5
  Bottom 0.61: Q1.2 62.33,128.83 61.5,128 61.5,126 60.65,125.15 C5.2
N$8
  Bottom 0.305: C4.2 58.89,122.74 IC2.6
  Bottom 0.61: Q1.1 62.33,119.17 61.5,120 61.5,123 60.65,123.85 C4.2
N$9
  Bottom 0.61: R58.1 91.52,145.37 J7.1
N$10
  Bottom 0.254: J1.1 96.61,13.11 101.75,18.25 101.75,20.25 102.09,20.59 102.09,94.91 96.5,100.5 R21.2
N$11
  Bottom 0.61: 76.54,95 76.54,95.39 R25.2 C28.1 R21.1 | 76.54,95 IC7.13 | 76.54,95 75.89,95.65 R23.1
N$12
  Bottom 0.254: LED1.3 22.11,154.96 R1.2
N$13
  Bottom 0.305: IC2.47 44.44,124.74 C22.1
N$14
  Bottom 0.61: IC5.6 71.46,110.61 R13.2 C14.1 R14.1 72.75,103.6 R15.1
N$15
  Bottom 0.61: IC7.2 76.54,86.61 R31.2 C36.1 R34.1 75.25,79.6 R36.1
N$16
  Bottom 0.61: U1.3 2.55,94.82 2.55,104.96 C2.+ 3,108.93 R2.1
N$17
  Bottom 0.406: IC6.16 28.6,104.75 C35.1
  Bottom 0.61: C34.+ 27,103.15 C35.1
N$18
  Bottom 0.61: R54.1 C49.1 R51.2 49.3,64.45 C40.-
N$19
  Bottom 0.254: IC2.31 48.74,113.84 C16.1
N$20
  Bottom 0.61: R60.1 13.06,145.37 J13.1
N$21
  Bottom 0.61: R54.2 46.83,57.68 J5.S
N$22
  Bottom 0.254: LED1.1 17.85,152.32 R3.2
N$23
  Bottom 0.61: R43.2 R38.2 36.45,94.15 C33.-
N$24
  Bottom 0.406: LED5.A 14.54,52.77 15.24,52.07 15.88,52.07 17.02,53.22 R67.1
N$25
  Bottom 0.61: IC8.6 38.78,87.64 R42.2 C43.1 R44.1 R43.1
N$26  (via drill 0.35)
  Top 0.254: v35.25,13.75 48.5,13.75 49.41,14.66 v57,14.66
  Bottom 0.254: J3.1 34.61,13.11 v35.25,13.75 | v57,14.66 58,15.66 58,22.75 63.25,28 63.25,48 66,50.75 66,70 68,72 68,80.35 R35.2
N$27
  Bottom 0.254: LED2.3 86,151.97 R4.2
N$28
  Bottom 0.61: R56.2 39.15,86 R42.1 | R42.1 C43.2 | R42.1 38.78,86.36 IC8.7
N$29  (via drill 0.35)
  Top 0.254: v68.5,70.25 68,70.75 59.5,70.75 52,78.25 52,86.75 49.75,89 v43.75,89
  Bottom 0.254: J8.S 87.12,54.46 79.26,62.32 72.43,62.32 69.23,65.52 69.23,68.35 68.5,69.08 v68.5,70.25 | R56.1 41.75,84 42.75,85 42.75,88 v43.75,89
N$30
  Bottom 0.61: IC7.6 71.46,86.61 R32.2 C38.1 R35.1 72.75,79.6 R37.1
N$31
  Bottom 0.61: C32.- 31.55,94.15 R33.2 R40.2
N$32
  Bottom 0.61: R40.1 R39.1 C42.1 R41.2 29.23,86.36 IC8.2
N$33
  Bottom 0.61: C42.2 R41.1 | R41.1 29,82.9 R55.2 | R41.1 29.2,85.09 IC8.1
N$34  (via drill 0.35)
  Top 0.254: v30.5,79.92 30.58,79.83 30.58,74.17 36.75,68 v67.75,68
  Bottom 0.254: J9.S 68.42,67.33 v67.75,68 | v30.5,79.92 29.41,81 28,81 27.15,81.85 R55.1
N$35
  Bottom 0.254: LED2.1 82,151.97 R5.2
N$36
  Bottom 0.406: R66.1 60.36,9.85 LED4.A
N$37  (via drill 0.35)
  Top 0.254: v36.83,148.27 26.04,148.27 v25.72,148.59
  Bottom 0.254: IC2.52 49.74,128.26 49.69,128.31 49.69,128.56 48.81,129.44 46.49,129.44 45.3,130.62 38.29,130.62 37.15,131.76 37.15,147.96 v36.83,148.27 | R3.1 16.15,151.6 17.57,150.18 24.13,150.18 v25.72,148.59
N$38
  Bottom 0.61: J12.1 6.78,57.37 R62.1
N$39
  Bottom 0.61: J5.C 52.07,59.92 R53.2
N$40  (via drill 0.35)
  Top 0.254: v86,146.75 86,136.12 v73.58,123.71 | v67.52,116.38 67.27,116.12 62.75,116.12 61,117.88 61,119.81 v59.06,121.75
  Bottom 0.254: v86,146.75 R4.1 | IC2.8 57.94,121.75 v59.06,121.75 | v73.58,123.71 67.52,117.64 v67.52,116.38
N$41
  Bottom 0.254: C24.2 28.35,108.85 29.02,109.52 29.02,110.26 29.36,110.6 IC6.25
  Bottom 0.61: Q3.2 25.67,104.67 26.5,105.5 26.5,108 27.35,108.85 C24.2
N$42
  Bottom 0.254: C23.2 29.1,111.25 IC6.26
  Bottom 0.61: Q3.1 23.37,114 25.5,114 26.5,113 26.5,111 27.35,110.15 C23.2
N$43  (via drill 0.35)
  Top 0.254: v28.57,147.64 37.47,147.64 v37.78,147.32
  Bottom 0.254: IC2.53 50.24,128.33 50.09,128.48 50.09,128.91 49.16,129.84 46.66,129.84 43.44,133.06 38.42,133.06 37.78,133.69 v37.78,147.32 | R1.1 23.85,151.73 27.94,147.64 v28.57,147.64
N$44  (via drill 0.35)
  Top 0.254: v48,130.5 v48,128.75
  Bottom 0.254: R5.1 74.9,148.15 61.75,135 60.5,135 59.44,133.94 57.07,133.94 55.5,132.37 55.5,131.5 55,131 48.5,131 v48,130.5 | v48,128.75 48.45,128.3 49,128.3 49.24,128.07 IC2.51
N$45  (via drill 0.35)
  Top 0.254: v69.25,71 69.25,72.25 67.75,73.75 57.5,73.75 52.75,78.5 52.75,90.5 44.45,98.8 v42.95,98.8 | v37,99.75 v34.25,99.75
  Bottom 0.254: J8.C 85.65,57 79.51,63.13 72.83,63.13 69.63,66.33 69.63,68.52 69.25,68.9 v69.25,71 | v42.95,98.8 37.95,98.8 v37,99.75 | v34.25,99.75 30.5,99.75 26.75,96 R39.2
N$46  (via drill 0.35)
  Top 0.254: v67.75,69.25 59.5,69.25 51.25,77.5 51.25,86.5 50,87.75 43.5,87.75 42.75,88.5 42.75,91.5 v42.5,91.75
  Bottom 0.254: v67.75,69.25 68.82,68.18 68.82,64.34 P2.1 | v42.5,91.75 42.4,91.85 R44.2
N$47
  Bottom 0.254: J9.C 75.56,58.91 P2.2
N$48  (via drill 0.35)
  Top 0.61: v28.89,132.72 v10.79,132.72
  Bottom 0.61: L2.2 29.14,132.46 v28.89,132.72 | v10.79,132.72 9.94,133.57 P1.2
N$49  (via drill 0.35)
  Top 0.61: v2.86,140.34 18.64,140.34 P1.5
  Bottom 0.61: v2.86,140.34 L4.2
N$50  (via drill 0.35)
  Top 0.61: v14.61,142.88 14.92,143.19 v30.48,143.19
  Bottom 0.61: P1.3 13.89,142.16 v14.61,142.88 | v30.48,143.19 30.73,143.44 L1.2
N$51
  Bottom 0.406: LED3.A 36.12,54.68 36.95,53.85 R65.1
N$52
  Bottom 0.61: J2.1 47.96,13.11 R63.1
N$53
  Bottom 0.61: J6.1 26.22,57.37 R64.1
N$57
  Bottom 0.61: IC5.14 IC5.13
N$58
  Bottom 0.61: IC5.9 IC5.8
N$66
  Bottom 0.61: R11.2 83.85,64 Q2.B
NORMAL_FM_CTRL  (via drill 0.35)
  Top 0.254: v46.5,14.5 v43.5,14.5
  Bottom 0.254: R66.2 59.87,8.15 53.52,14.5 v46.5,14.5 | v43.5,14.5 41.91,16.09 41.91,57.78 40.64,59.05 37.38,59.05 32.88,63.56 32.88,67.24 30.18,69.94 U3.15 30.18,77.17 33.19,80.19 40.76,80.19 41.08,80.5 41.75,80.5 44.62,83.38 44.62,95.38 51.4,102.15 51.4,114.47 51.74,114.81 IC2.25
NORMAL_FM_SW  (via drill 0.35)
  Top 0.254: v56.5,115.5 59.38,112.62 59.38,104.06 58.81,103.5 58.81,101.44 59.38,100.88 59.38,97.62 v58.5,96.75 | v58.5,91.75 58.5,86.7 SW6.4
  Bottom 0.254: v58.5,91.75 v58.5,96.75 | v56.5,115.5 56.42,115.58 IC2.17
  Bottom 0.61: SW6.4 SW6.3
NORMAL_PITCH_CTRL  (via drill 0.35)
  Top 0.254: v30.48,119.06 30,118.59 30,101.19 23.75,94.93 v23.75,88.25 | v30.25,61.34 23.91,61.34 v21,64.25 | v36.5,52.75 v38.5,50.75
  Bottom 0.254: IC2.38 45.45,120.24 45.22,120.47 45.22,120.75 44.72,121.25 32.67,121.25 v30.48,119.06 | v23.75,88.25 23.75,71.67 U3.10 23.75,71.52 23.75,70.25 20.75,67.25 20.75,64.5 v21,64.25 | v30.25,61.34 33.25,58.34 33.25,55.95 36.45,52.75 v36.5,52.75 | v38.5,50.75 38.75,50.75 39.25,51.25 39.25,51.9 R65.2
NORMAL_PITCH_SW  (via drill 0.35)
  Top 0.254: v57.25,100 57.25,100.25 54.75,102.75 54.75,111.75 53.75,112.75 51.25,112.75 49,115 v49,117.5 | SW7.4 57.25,81.93 v57.25,91.75
  Bottom 0.254: v57.25,91.75 v57.25,100 | IC2.41 48.01,121.74 48.75,121 48.75,119.75 49,119.5 v49,117.5
  Bottom 0.61: SW7.4 SW7.3
NORMAL_STRUM_CTRL  (via drill 0.35)
  Top 0.254: v17.5,50.37 17.5,50.25 24,43.75 74.75,43.75 88.75,57.75 v88.75,65.75 | v34,66.5 32.25,64.75 v32.22,64.75 | v18.75,53 v24.25,58.5 | v39.75,72.25 39.75,109.25 v41,110.5 | v81.25,73.5 v85,73.5
  Bottom 0.254: IC2.37 46.76,119.74 47.75,118.75 47.75,117.67 46.98,116.9 43.04,112.96 43.04,112.54 v41,110.5 | v17.5,50.37 R67.2 17.9,51.52 18.75,52.37 v18.75,53 | v81.25,73.5 80.17,72.42 U2.15 | v34,66.5 v39.75,72.25 | v32.22,64.75 25.97,58.5 v24.25,58.5 | v85,73.5 88.75,69.75 v88.75,65.75
NORMAL_STRUM_SW  (via drill 0.35)
  Top 0.254: SW5.4 44.25,80.94 v44.25,81 | v56,91.75 56,82.25 v54.75,81 | v54,101 52.25,102.75 v52.25,109
  Top 0.61: SW5.4 SW5.3
  Bottom 0.254: v56,91.75 56,99 v54,101 | IC2.24 52.24,114.74 51.81,114.31 51.81,109.44 v52.25,109 | v44.25,81 v54.75,81
NORMALIZATION_PROBE  (via drill 0.35)
  Top 0.254: v42,110.5 40.5,109 v40.5,71
  Bottom 0.254: IC2.39 46.76,120.74 48.25,119.25 48.25,117.5 43.44,112.69 43.44,112.37 42,110.92 v42,110.5 | v40.5,71 43.25,68.25 51.5,68.25 53.85,65.9 R57.1
  Bottom 0.61: D3.3 R53.1 R57.1 R52.1
PITCH_INPUT  (via drill 0.35)
  Top 0.254: v19.25,62.84 v19.25,60.5
  Bottom 0.254: v19.25,62.84 19.25,68.29 U3.9 | D7.3 20.5,54 19.25,55.25 v19.25,60.5
  Bottom 0.61: R64.2 24.15,54.05 D7.3
PITCH_SOURCE  (via drill 0.35)
  Top 0.254: v42,83.25 v45.5,86.75 | v59.5,102.75 62.25,105.5 v62.75,105.5
  Bottom 0.254: U3.8 22.55,65.19 23.25,64.5 24.5,64.5 25.09,65.09 25.09,66.75 | U3.6 25.09,67.09 27,69 27,75.15 32.85,81 39.75,81 v42,83.25 | v45.5,86.75 54.5,86.75 60,92.25 60,101.25 59.5,101.75 v59.5,102.75 | v62.75,105.5 R14.2
  Bottom 0.305: U3.6 25.09,66.75
POSITION_ATT  (via drill 0.35)
  Top 0.254: v55,38.75 54,37.75 32.75,37.75 30.4,35.4 v30.4,25.9
  Bottom 0.254: v55,38.75 55.17,38.92 U4.15 | v30.4,25.9 30.4,17.53 R49.P$2
POSITION_CV  (via drill 0.35)
  Top 0.254: v52.5,113.5 52.84,113.16 53.92,113.16 55.75,111.33 v55.75,108.5
  Bottom 0.254: IC2.23 52.74,114.66 52.29,114.21 52.29,113.71 v52.5,113.5 | v55.75,108.5 55.75,107.5 65.5,97.75 65.5,93.25 70.19,88.56 IC7.7
  Bottom 0.61: IC7.7 69.15,87.36 R32.1 C38.2
POSITION_POT  (via drill 0.35)
  Top 0.254: v46.5,39.25 25.25,39.25 15.75,48.75 v15.75,53.75 | v15.75,60.5 v15.75,68.5
  Bottom 0.254: v46.5,39.25 51,39.25 51.37,39.62 U4.12 | v15.75,68.5 15.75,75.78 R30.P$2 | v15.75,53.75 v15.75,60.5
RESET  (via drill 0.35)
  Top 0.305: JP1.10 54.52,131.26 53.25,130 53.25,125.5 56.5,122.25 v56.75,122.25
  Bottom 0.305: SW3.B 60.63,135.88 59.12,134.38 56.89,134.38 JP1.10 | v56.75,122.25 57.91,122.25 IC2.7
  Bottom 0.61: R6.1 58.03,156 SW3.B' SW3.B
RX  (via drill 0.35)
  Top 0.254: JP2.4 41.7,132.31 41.7,124.05 v42.75,123
  Bottom 0.254: v42.75,123 43.75,123 44.01,122.74 IC2.43
STRUM  (via drill 0.35)
  Top 0.254: v56.75,125.25 57.82,126.32 57.82,127.57 63,132.75 v68.25,132.75 | v81.5,106.5 v81.5,89.5
  Bottom 0.254: IC2.16 56.4,117.74 55.66,117 51.75,117 51.14,117.61 51.14,121.64 51.94,122.44 53.94,122.44 v56.75,125.25 | v68.25,132.75 68.37,132.87 80.81,132.87 81.5,132.18 v81.5,106.5 | v81.5,89.5 81.5,75.5 85.25,71.75 85.25,68.6 R8.1
  Bottom 0.61: Q2.C 85.85,65.25 R8.1
STRUM_INPUT  (via drill 0.35)
  Top 0.254: v21.5,44.5 22.75,43.25 75.75,43.25 90,57.5 v90,65.75 | v83,72.5 v87,72.5
  Bottom 0.254: R62.2 5.85,59.85 2.25,56.25 2.25,47.5 5.25,44.5 v21.5,44.5 | U2.16 82.35,72.5 v83,72.5 | v90,65.75 90,68.5 90,69 90,69.5 v87,72.5
  Bottom 0.61: R62.2 6,62.9 D5.3
STRUM_NORM  (via drill 0.35)
  Top 0.254: v59,63 64,63 v70.5,69.5
  Bottom 0.254: R52.2 v59,63 | v70.5,69.5 73.75,69.5 75.12,68.12 77.12,68.12 77.64,67.61 U2.4
STRUM_SOURCE
  Bottom 0.61: R11.1 79.5,64 78.91,64.59 U2.3 78.91,67.66 79.5,68.25 80.75,68.25 81.44,67.56 U2.1
SW_MODE  (via drill 0.35)
  Top 0.254: v64.5,135 57.38,127.89 57.38,127.14 v57.07,126.82
  Top 0.305: v71,145.25 71,141.5 v69,139.5
  Bottom 0.254: v57.07,126.82 56,125.75 54.75,125.75 54.24,126.26 IC2.61
  Bottom 0.305: v64.5,135 v69,139.5 | v71,145.25 SW10.3
  Bottom 0.61: SW10.4 SW10.3
SW_POLYPHONY  (via drill 0.35)
  Top 0.254: v59,135.5 59,132 56.5,129.5 v55.57,129.5 | v58.88,149.5 57.38,151 29.5,151 SW11.3
  Bottom 0.254: v59,135.5 59.63,136.13 59.63,148.75 v58.88,149.5 | IC2.62 54.74,128.67 v55.57,129.5
  Bottom 0.61: SW11.4 SW11.3
TX  (via drill 0.35)
  Top 0.254: JP2.5 41.2,130.27 41.2,123.05 v42,122.25
  Bottom 0.254: v42,122.25 42.01,122.24 IC2.42
V_OCT_CV  (via drill 0.35)
  Top 0.254: v56.75,124.25 58.32,125.82 58.32,127.32 63.25,132.25 66.5,132.25 70.25,128.5 v70.25,126.25 | v70.25,123.5 v70.25,114.12
  Bottom 0.254: IC2.15 56.12,118.24 55.38,117.5 52,117.5 51.55,117.95 51.55,121.25 52.33,122.03 54.28,122.03 56.5,124.25 v56.75,124.25 | v70.25,126.25 v70.25,123.5 | IC5.7 70.25,112.46 v70.25,114.12
  Bottom 0.61: IC5.7 69.15,111.36 R13.1 C14.2
VCC  (via drill 0.35)
  Top 0.61: v19.79,108.36 19.79,86.74 17.25,84.2 17.25,83.25 | 17.25,83.25 17.25,82.5 19,80.75 22.5,80.75 | v20.25,55.75 19.11,54.61 15,54.61 | v13.36,54.61 15,54.61 | v36.75,81.75 35.75,80.75 28.25,80.75 | 22.5,80.75 28.25,80.75 | v25,73.25 25,78.25 22.5,80.75 | 17.25,83.25 v15.75,81.75 | 15,54.61 14.75,54.36 14.75,39.75 v37.75,16.75 | 28.25,80.75 30,79 30,73.75 36.5,67.25 36.5,63.5 39.5,60.5 62.75,60.5 71.75,69.5 71.75,71.5 73.5,73.25 v74.75,73.25 | v30.48,141.6 16.83,141.6 v16.51,141.29
  Bottom 0.61: IC8.8 36.85,84.84 C39.1 36.85,81.85 v36.75,81.75 | v13.36,54.61 12,55.97 12,62 5.62,68.38 5.62,71.62 | v20.25,55.75 21.1,55.75 D7.2 | v25,73.25 25,71.69 U3.11 | 5.62,71.62 3.9,69.9 D5.2 | D6.2 43.55,10.95 v37.75,16.75 | v74.75,73.25 75.09,72.91 U2.11 | v19.79,108.36 20.07,108.64 20.07,116.57 15.88,120.76 15.88,140.65 v16.51,141.29 | v15.75,81.75 5.62,71.62 | L1.1 33.66,143.14 C3.+ 33.48,141.6 v30.48,141.6
VEE  (via drill 0.35)
  Top 0.61: v29.66,88.91 25.34,88.91 v25.25,89 | v27.25,79.75 28.75,78.25 v28.75,74.25 28.75,73.25 35.25,66.75 35.25,63 | 35.25,63 39,59.25 63.5,59.25 77.5,73.25 v78.75,73.25 | v24,60.5 32.75,60.5 35.25,63 | v4.75,60.75 12.5,60.75 v13.5,61.75 | v23,56 23,51.75 v22.5,51.25 | v31.43,125.09 24.13,125.09 v22.54,123.51
  Bottom 0.61: C45.2 31.15,89.16 IC8.4 v29.66,88.91 | 24.62,89.62 20.86,93.39 20.86,118.61 22.56,120.31 22.56,123.49 v22.54,123.51 | 24.62,89.62 v25.25,89 | 24.62,89.62 24.62,82.38 v27.25,79.75 | U2.14 78.91,73.09 v78.75,73.25 | D7.1 21.9,51.85 v22.5,51.25 22.5,35.75 32,26.25 32,21 42.38,10.62 42.38,10.57 D6.1 | D5.1 3.9,61 4.15,60.75 v4.75,60.75 | v13.5,61.75 22.75,61.75 v24,60.5 22.5,59 22.5,58.25 23,57.75 v23,56 | U3.14 28.91,74.09 v28.75,74.25 | L2.1 32.51,129.08 C1.- 33.97,127.32 33.15,126.5 R12.1 32.34,126 v31.43,125.09

## Text on the board
tPlace: BANANA | BANANA | RG | RG | 17mm pot | AMB | AMB | BANANA | BANANA | SW | SW | SW | AMB | BANANA | BANANA | BANANA | BANANA | BANANA
bPlace: Boot_Flash | Reset | BANANA | RG | RG | BANANA | GND | <TX | Original hardware and code: / E. Gillet CC-BY-SA 3.0 | STM32F405RGT6 | WM8731 | LD1117 / 3V3 | 17mm pot | TL072 | OFF | ON | AMB | AMB | BANANA | BANANA | SW | SW | SW | AMB | BANANA | BANANA | BANANA | BANANA | BANANA